# EAGLE schematic proximity (EAGLE 5.11)
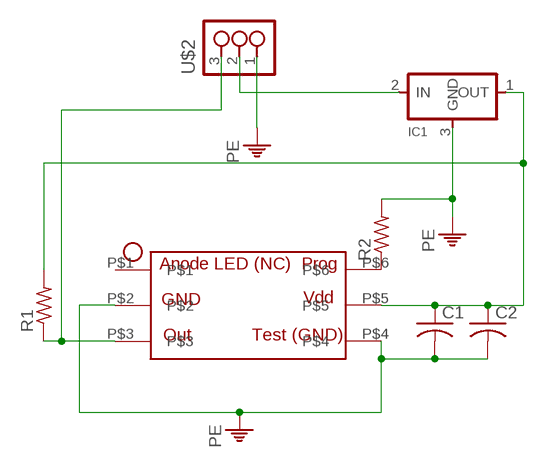
[diagram p0: schematic, sheet 1]

## Parts
C1  C-USC1206  [C1206]
C2  C-USC4532  [C4532]
IC1  REGULATORSOT23  [SOT23]
R1  RESISTOR1206  [1206]
R2  RESISTOR1206  [1206]
U$1  SFH7741  [SFH7741-SMD]
U$2  3_PIN_HEADERHEADER  [SMT_PINS_3]

## Nets
N$1: C1.1 C2.1 IC1.1(OUT) R1.2 U$1.P$5
N$2: IC1.2(IN) U$2.2
N$3: R1.1 U$1.P$3 U$2.3
N$4: R2.1 U$1.P$6
PE: C1.2 C2.2 IC1.3(GND) R2.2 U$1.P$2 U$1.P$4 U$2.1
Unconnected: U$1.P$1

## Library data of the parts
C1 C2 = rcl:C-US: CAPACITOR, American symbol
IC1 = ng:REGULATOR
R1 R2 = ng:RESISTOR
U$1 = rfc:SFH7741: 3.6 V IR proximity sensor. SMD
U$2 = ng:3_PIN_HEADER: 3 SMT pin pads